# Altium schematic sheet Circuito_part2_Altium..SchDoc: Circuito de Controle Parte 2
size A4; DrawnBy: Lucas Aragão Rodrigues
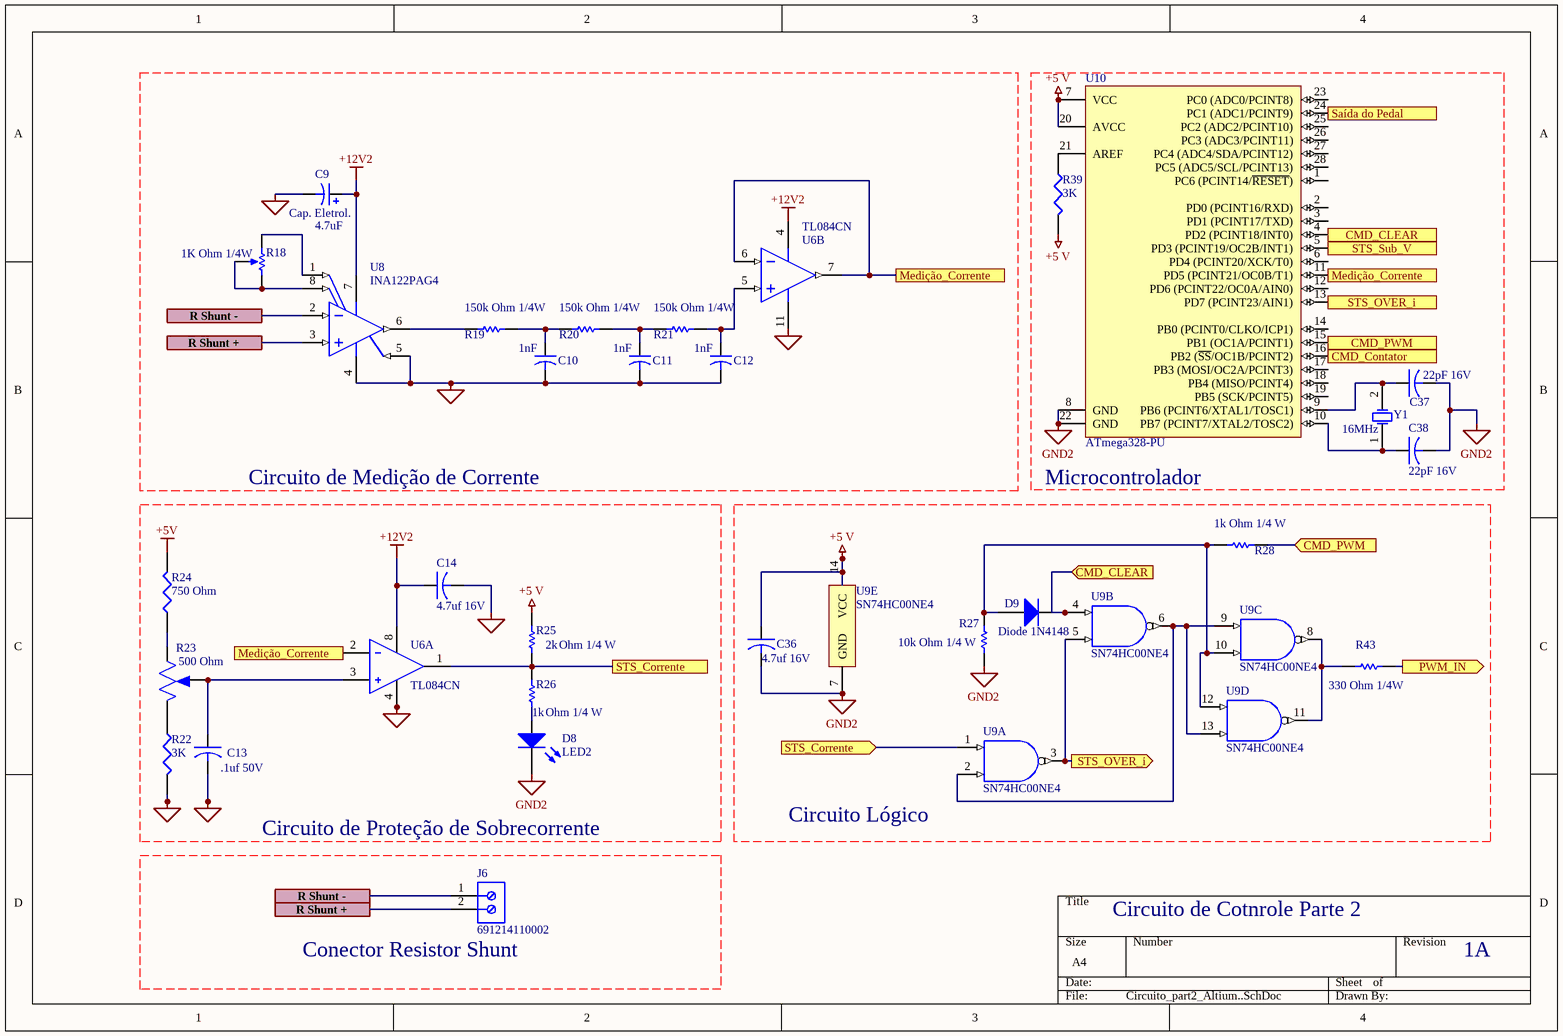
[diagram p0: Circuito_part2_Altium..SchDoc]

## Parts
(Parts that share a designator on the sheet are numbered #1, #2 ... from top to bottom, then left to right.)
C9  Cap. Eletrol.  value 4.7uF  [RB7.6-15]
C10  value 1nF  [CAPR5-4X5]  (hidden comment: Cap. Cera.)
C11  value 1nF  [CAPR5-4X5]  (hidden comment: Cap2)
C12  value 1nF  [CAPR5-4X5]  (hidden comment: Cap2)
C13  .1uf 50V  [RAD0.2]
C14  4.7uf 16V  [RAD0.2]
C36  4.7uf 16V  [RAD0.2]
C37  22pF 16V  [RAD0.2]
C38  22pF 16V  [RAD0.2]
D8  LED2  [3.2X1.6X1.1]
D9  Diode 1N4148  [DO-35]
J6  691214110002  [691214110002]
R18  value 1K Ohm 1/4W  [VR5]
R19  value 150k Ohm 1/4W  [AXIAL-0.3]  (hidden comment: Ohm 1/4W)
R20  value 150k Ohm 1/4W  [AXIAL-0.3]  (hidden comment: Ohm 1/4W)
R21  value 150k Ohm 1/4W  [AXIAL-0.3]
R22  3K  [AXIAL0.4]
R23  500 Ohm  [VR_CT6]
R24  750 Ohm  [AXIAL0.4]
R25  Ohm 1/4 W  value 2k  [AXIAL-0.3]
R26  Ohm 1/4 W  value 1k  [AXIAL-0.3]
R27  10k Ohm 1/4 W  [AXIAL-0.3]
R28  1k Ohm 1/4 W  [AXIAL-0.3]
R39  3K  [AXIAL0.4]
R43  value 330 Ohm 1/4W  [AXIAL-0.3]
U6#1  TL084CN  [N0014A]  (part B of 4)
U6#2  TL084CN  [DIP8]  (part A of 2)
U8  INA122PAG4  [P0008A]
U9  SN74HC00NE4  [N0014A]  (parts A,B,C,D,E of 5)
U10  ATmega328-PU  [28P3]
Y1  16MHz  [R38]

## Ports
CMD_CLEAR (in), CMD_Contator, CMD_PWM (in), Medição_Corrente, PWM_IN (out), R Shunt +, R Shunt -, Saída do Pedal (in), STS_Corrente, STS_Corrente (in), STS_OVER_i (out), STS_Sub_V

## Nets
+5 V: C36.1 R25.1 R39.2 U9.14(VCC) U10.7(VCC) U10.20(AVCC)
+5V: R24.2
+12V2: C9.1 C14.1 U6#1.4(VCC+) U6#2.8(VCC) U8.7(V+)
GND2: C9.2 C10.2 C11.2 C12.2 C36.2 C37.2 C38.2 D8.2(K) R27.2 U6#1.11(VCC-) U8.4(V-) U8.5(REF) U9.7(GND) U10.8(GND) U10.22(GND)
SGND: C13.2 C14.2 R22.2 U6#2.4(VEE)
CMD_CLEAR: D9.2(K) U9.4(2A) U10.4(PD2_(PCINT18/INT0)) ; port CMD_CLEAR
CMD_Contator: U10.16(PB2_(~{SS}/OC1B/PCINT2)) ; port CMD_Contator
CMD_PWM: R28.2 U10.15(PB1_(OC1A/PCINT1)) ; port CMD_PWM
Medição_Corrente: U6#1.6(IN2-) U6#1.7(OUT2) U6#2.2(INA-) U10.11(PD5_(PCINT21/OC0B/T1)) ; port Medição_Corrente
PWM_IN: R43.2 ; port PWM_IN
R Shunt +: J6.2 U8.3(VIN+) ; port R Shunt +
R Shunt -: J6.1 U8.2(VIN-) ; port R Shunt -
Saída do Pedal: U10.24(PC1_(ADC1/PCINT9)) ; port Saída do Pedal
STS_Corrente: R25.2 R26.1 U6#2.1(VOA) U9.1(1A) ; port STS_Corrente
STS_OVER_i: U9.3(1Y) U9.5(2B) U10.13(PD7_(PCINT23/AIN1)) ; port STS_OVER_i
STS_Sub_V: U10.5(PD3_(PCINT19/OC2B/INT1)) ; port STS_Sub_V
NetC10_1: C10.1 R19.2 R20.1
NetC11_1: C11.1 R20.2 R21.1
NetC12_1: C12.1 R21.2 U6#1.5(IN2+)
NetC13_1: C13.1 R23.2 U6#2.3(INA+)
NetC37_1: C37.1 U10.9(PB6_(PCINT6/XTAL1/TOSC1)) Y1.2(OSC2)
NetC38_1: C38.1 U10.10(PB7_(PCINT7/XTAL2/TOSC2)) Y1.1(OSC1)
NetD8_1: D8.1(A) R26.2
NetD9_1: D9.1(A) R27.1 R28.1 U9.10(3B) U9.12(4A)
NetR18_1: R18.1(TOP) U8.1(RG)
NetR18_2: R18.2(BOT) R18.3(TAP) U8.8(RG)
NetR19_1: R19.1 U8.6(VO)
NetR22_1: R22.1 R23.1
NetR23_3: R23.3 R24.1
NetR39_1: R39.1 U10.21(AREF)
NetR43_1: R43.1 U9.8(3Y) U9.11(4Y)
NetU9_2: U9.2(1B) U9.6(2Y) U9.9(3A) U9.13(4B)

Not connected (* = marked no-connect by the designer): U10 1(PC6_(PCINT14/~{RESET})) 2(PD0_(PCINT16/RXD)) 3(PD1_(PCINT17/TXD)) 6(PD4_(PCINT20/XCK/T0)) 12(PD6_(PCINT22/OC0A/AIN0)) 14(PB0_(PCINT0/CLKO/ICP1)) 17(PB3_(MOSI/OC2A/PCINT3)) 18(PB4_(MISO/PCINT4)) 19(PB5_(SCK/PCINT5)) 23(PC0_(ADC0/PCINT8)) 25(PC2_(ADC2/PCINT10)) 26(PC3_(ADC3/PCINT11)) 27(PC4_(ADC4/SDA/PCINT12)) 28(PC5_(ADC5/SCL/PCINT13))

## Notes on the sheet
- Circuito de Medição de Corrente
- Microcontrolador
- Circuito de Proteção de Sobrecorrente
- (near U9) Circuito Lógico
- Circuito de Cotnrole Parte 2
- (near J6) Conector Resistor Shunt
- 1A

## Library data of the parts
C9 = Cap Pol1: Polarized Capacitor (Radial); Published: 8-Jun-2000; LatestRevisionDate: 17-Jul-2002; LatestRevisionNote: Re-released for DXP Platform.; PackageReference: RB7.6-15; Publisher: Altium Limited; PackageDescription: Polarized Capacitor (Radial); 2 Leads
C10-C12 = Cap2: Capacitor; Published: 23-Sep-2002; PackageReference: CAPR5-4X5; Publisher: Altium Limited; PackageDescription: Capacitor; 2 Leads
C13 C14 C36-C38 = CAPACITOR
D8 = LED2: +5 V; Published: 8-Jun-2000; LatestRevisionDate: 17-Jul-2002; LatestRevisionNote: Re-released for DXP Platform.; PackageVersion: Feb-2002; PackageReference: 3.2X1.6X1.1; Publisher: Altium Limited; PackageDescription: SM LED; 2 Flat Leads
D9 = Diode 1N4148: High Conductance Fast Diode; Published: 8-Jun-2000; LatestRevisionDate: 17-Jul-2002; LatestRevisionNote: Re-released for DXP Platform.; DatasheetVersion: 1997; PackageReference: DO-35; Publisher: Altium Limited; PackageDescription: Diode, Axial; Body 3.8 x 1.9 mm (LxDia. max), Lead Dia. 0.53 mm (max); Code_JEDEC: DO-204-AH; ComponentLink1Description: Manufacturer Link; ComponentLink1URL: http://www.fairchildsemi.com/; ComponentLink2Description: Datasheet; ComponentLink2URL: http://www.fairchildsemi.com/ds/1N%2F1N4148.pdf
J6 = CMP-1502-02464-2: NexarPartId: 18818288; Plating: Brass, Steel; Current: 10A; Pitch: 3.5052mm; Number of Levels: 1; Number of Contacts: 2; Wire Gauge (Min): 16AWG; Voltage: 300V; Wire Gauge (Max): 24AWG; Stripping Length: -6mm; Number of Pins: 2; Number of Rows: 1; REACH SVHC: Unknown; RoHS: Compliant; Housing Material: Nylon; Termination: Screw; Mount: Through Hole; Contact Plating: Brass, Tin; Number of Positions Per Level: 2; Color: Blue, Green; Width: 7.9mm; Voltage Rating: 300V; Length: 7.4mm; Current Rating: 10A; Wire/Cable Gauge: 24AWG; Packaging: Box; Max Operating Temperature: 105°C; Lead Pitch: 3.5mm; Height: 8.7mm; Contact Material: Brass; Min Operating Temperature: -40°C
R18 = RPot: Potentiometer; Sim Note: Enter the Resistance value and the set point into parameter fields.; Set Position: 0.5; Published: 8-Jun-2000; LatestRevisionDate: 17-Jul-2002; LatestRevisionNote: Re-released for DXP Platform.; PackageReference: VR5; Publisher: Altium Limited; PackageDescription: Variable Resistor, Thru-Hole; 3 Leads
R19-R21 R25-R28 R43 = Res1: Resistor; Published: 8-Jun-2000; LatestRevisionDate: 17-Jul-2002; LatestRevisionNote: Re-released for DXP Platform.; PackageReference: AXIAL-0.3; Publisher: Altium Limited; PackageDescription: Axial Device, Thru-Hole; 2 Leads; 0.3 in Pin Spacing
R22 R24 R39 = RES1
R23 = MYPOT
U6#1 = CMP-0017-00818-2: JFET-Input Operational Amplifier, 7 to 36 V, 0 to 70 degC, 14-pin DIP (N14), Pb-Free (RoHS); Manufacturer: Texas Instruments; Rating: Catalog; Iq per channel(Max)(mA): 2.8; Number of Channels: 4; IIB(Max)(pA): 400; Vio (25C)(Max)(mV): 15; GBW(Typ)(MHz): 3; Total Supply Voltage(Max)(+5V is 5, +/-5V is 10): 36; Vn at 1kHz(Typ)(nV/rtHz): 18; Sub Family: General Purpose Amplifier, High Supply Voltage Amplifier (>=30V); Slew Rate(Typ)(V/us): 13; Total Supply Voltage(Min)(+5V is 5, +/-5V is 10): 7; CMRR(Min)(dB): 70; ComponentLink3Description: Package Specification; PackageDescription: 14-Pin Plastic In-Line, Body 19.305 x 6.35 mm, Pitch 2.54 mm; ComponentLink1Description: Manufacturer URL; PackageVersion: 4040049/E, 12/2002; Eco-Plan: Pb-Free (RoHS); ComponentLink2URL: http://www.ti.com/lit/ds/symlink/tl084.pdf; ComponentLink1URL: http://www.ti.com/; DatasheetVersion: SLOS081G; Mounting Technology: Through Hole; PartNumber: TL084CN; Offset Drift(Typ)(uV/C): 18; PackageReference: N0014A; ComponentLink3URL: http://www.ti.com/lit/ml/mpdi002c/mpdi002c.pdf; ComponentLink2Description: Datasheet; Code_JEDEC: MS-001
U6#2 = LM393M
U8 = CMP-0992-00133-2: Micropower Instrumentation Amplifier Single and Dual Versions, -40 to 85 degC, 8-pin DIP (P8), Green (RoHS & no Sb/Br); PartNumber: INA126PA; Manufacturer: Texas Instruments; Quiescent Current (+/-)(Typ)(mA): 0.175; Input Bias Current (+/-)(Max)(nA): 50; Noise at 1kHz(Typ)(nV/rt(Hz)): 35; Input Offset Drift (+/-)(Max)(uV/Degrees Celsius): 5; SubFamily: Dual Supply; CMRR(Min)(dB): 74; Input Offset (+/-)(Max)(uV): 500; Number of Channels: 1; Vs(Max)(V): 36; Gain(V/V): 5 to 10000; Vs(Min)(V): 2.7; Non-Linearity (+/-)(Max)(%): 0.012; PackageReference: P0008A; Eco-Plan: Green (RoHS & no Sb/Br); ComponentLink1URL: http://www.ti.com/; PackageDescription: 8-Pin Plastic In-Line, Body 9.59 x 6.35 mm, Pitch 2.54 mm; Mounting Technology: Through Hole; PackageVersion: 4040082/E, 04/2010; ComponentLink2URL: http://www.ti.com/general/docs/lit/getliterature.tsp?genericPartNumber=INA126&fileType=pdf; ComponentLink1Description: Manufacturer URL; DatasheetVersion: SBOS062A; Code_JEDEC: MS-001; ComponentLink3Description: Package Specification; ComponentLink3URL: http://www.ti.com/litv/pdf/mpdi001b; ComponentLink2Description: Datasheet
U9 = CMP-1627-00505-2: High Speed CMOS Logic Quad 2-Input NAND Gates, N0014A, TUBE; Generic Part Number: CD74HC00; Manufacturer: Texas Instruments; Schmitt Trigger: No; Voltage(Nom)(V): 5; Bits(#): 4; VCC(Max)(V): 6; Technology Family: HC; Rating: Catalog; ICC @ Nom Voltage(Max)(mA): 0.02; F @ Nom Voltage(Max)(Mhz): 70; VCC(Min)(V): 2; Output Drive (IOL/IOH)(Max)(mA): 4/-4; tpd @ Nom Voltage(Max)(ns): 20; PackageReference: N0014A; Code_JEDEC: MS-001; Operating Temperature Range(C): -55 to 125; DatasheetVersion: SCHS116C; Input Type: CMOS; Output Type: CMOS
U10 = CMP-0095-00015-2: 8-bit AVR Microcontroller, 32KB Flash, 1KB EEPROM, 2KB SRAM, 28-pin PDIP, Industrial Grade (-40°C to 85°C); ComponentLink3Description: ATmega48A/48PA/88A/88PA/168A/168PA/328/328P Summary; RevisionNote: DatasheetVersion updated. URLs added.; DatasheetVersion: revD, May-2011; ComponentLink1URL: http://www.atmel.com/; PackageVersion: revB, Sep-2001; PackageDescription: 28-lead (0.300"/7.62mm Wide) Plastic Dual Inline Package (PDIP); PackageReference: 28P3; ComponentLink1Description: Manufacturer URL; ComponentLink2Description: ATmega48A/48PA/88A/88PA/168A/168PA/328/328P Datasheet; ComponentLink3URL: http://www.atmel.com/dyn/resources/prod_documents/8271S.pdf; ComponentLink2URL: http://www.atmel.com/dyn/resources/prod_documents/8271.pdf
Y1 = XTAL: Crystal Oscillator; Published: 8-Jun-2000; LatestRevisionDate: 17-Jul-2002; LatestRevisionNote: Re-released for DXP Platform.; PackageReference: R38; Publisher: Altium Limited; PackageDescription: Crystal, Thru-Hole; 2 Leads; Body 3.1 x 8.2 mm (Dia.xH)